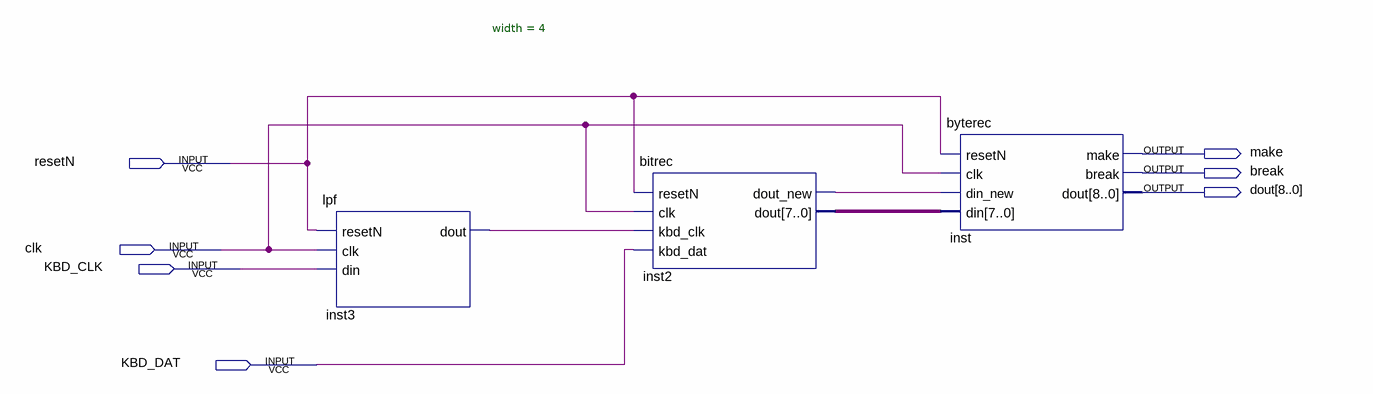
[diagram p0: schematic sheet]
// Quartus schematic KBD.bdf as structural Verilog: 3 symbols, 7 pins
module KBD (
  input  resetN,
  input  clk,
  input  KBD_CLK,
  input  KBD_DAT,
  output make,
  output \break ,
  output [8:0] dout
);

  wire inst2_dout_new, inst3_dout;
  wire [7:0] inst2_dout;

  lpf #(.width(4)) inst3 (.resetN(resetN), .clk(clk), .din(KBD_CLK), .dout(inst3_dout));
  bitrec inst2 (
    .resetN(resetN), .clk(clk), .kbd_clk(inst3_dout), .kbd_dat(KBD_DAT), .dout_new(inst2_dout_new),
    .dout(inst2_dout));
  byterec inst (
    .resetN(resetN), .clk(clk), .din_new(inst2_dout_new), .din(inst2_dout), .make(make), .\break (\break ),
    .dout(dout));
endmodule
